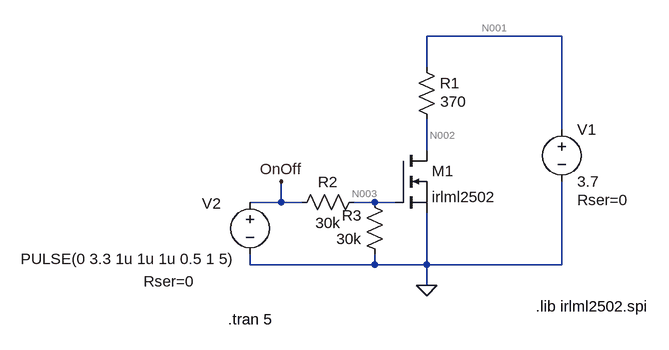
[diagram p0: schematic transistor_sim.asc]
transistor_sim.asc, the LTspice schematic file:
Version 4
SHEET 1 1180 1892
WIRE 384 -128 176 -128
WIRE 176 -80 176 -128
WIRE 384 16 384 -128
WIRE 176 48 176 0
WIRE -48 128 -48 96
WIRE -48 128 -96 128
WIRE -16 128 -48 128
WIRE 96 128 64 128
WIRE 128 128 96 128
WIRE -96 224 -96 208
WIRE 96 224 96 208
WIRE 96 224 -96 224
WIRE 176 224 176 144
WIRE 176 224 96 224
WIRE 384 224 384 96
WIRE 384 224 176 224
WIRE 176 256 176 224
FLAG 176 256 0
FLAG -48 96 OnOff
SYMBOL res 160 -96 R0
WINDOW 3 37 69 Left 2
SYMATTR InstName R1
SYMATTR Value 370
SYMBOL nmos 128 48 R0
SYMATTR InstName M1
SYMATTR Value irlml2502
SYMATTR Prefix X
SYMATTR SpiceModel irlml2502
SYMBOL voltage 384 0 R0
WINDOW 123 0 0 Left 0
WINDOW 39 24 124 Left 2
SYMATTR SpiceLine Rser=0
SYMATTR InstName V1
SYMATTR Value 3.7
SYMBOL voltage -96 112 R0
WINDOW 123 0 0 Left 0
WINDOW 39 -164 138 Left 2
WINDOW 0 -74 18 Left 2
WINDOW 3 -353 103 Left 2
SYMATTR SpiceLine Rser=0
SYMATTR InstName V2
SYMATTR Value PULSE(0 3.3 1u 1u 1u 0.5 1 5)
SYMBOL res 80 112 R90
WINDOW 0 0 56 VBottom 2
WINDOW 3 32 56 VTop 2
SYMATTR InstName R2
SYMATTR Value 30k
SYMBOL res 112 224 R180
WINDOW 0 36 76 Left 2
WINDOW 3 36 40 Left 2
SYMATTR InstName R3
SYMATTR Value 30k
TEXT 344 288 Left 2 !.lib irlml2502.spi
TEXT -130 308 Left 2 !.tran 5

The netlist it stands for:
* transistor_sim.asc
R1 N001 N002 370
XM1 N002 N003 0 irlml2502 irlml2502  ; pins D G S
V1 N001 0 3.7 Rser=0
V2 OnOff 0 PULSE(0 3.3 1u 1u 1u 0.5 1 5) Rser=0
R2 N003 OnOff 30k
R3 0 N003 30k
.lib irlml2502.spi
.tran 5
.backanno
.end

* Results of the author's LTspice run, read from the files saved beside the schematic
* Operating Point, zero values left out:
*   V(n001) = 3.7 V
*   V(n002) = 3.699 V
*   V(n003) = 55.48 nV
*   I(R1) = 3.703 µA
*   I(R2) = 1.849 pA
*   I(R3) = -1.849 pA
*   I(V1) = -3.703 µA
*   I(V2) = 1.849 pA
*   Ix(m1:1) = 3.703 µA
*   Ix(m1:2) = -3.699 pA
*   Ix(m1:3) = -3.703 µA
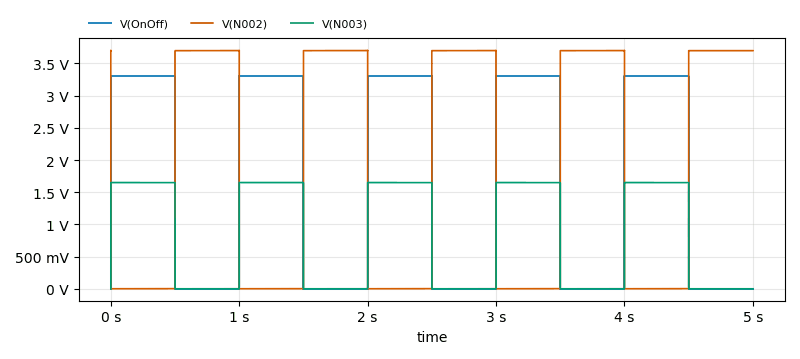
[diagram p1: Transient Analysis of transistor_sim.asc, plotted from the saved traces]
* Transient Analysis, 1 run:
*   V(OnOff): min 0 V, max 3.3 V, average 1.65 V, rms 2.333 V, last 0 V
*   V(N002): min 678.1 µV, max 3.703 V, average 1.85 V, rms 2.615 V, last 3.699 V
*   V(N003): min -28.43 µV, max 1.65 V, average 825 mV, rms 1.167 V, last 2.388 µV